# Altium schematic sheet Connectors.SchDoc
size Letter; SheetNumber: 1; SheetTotal: 9
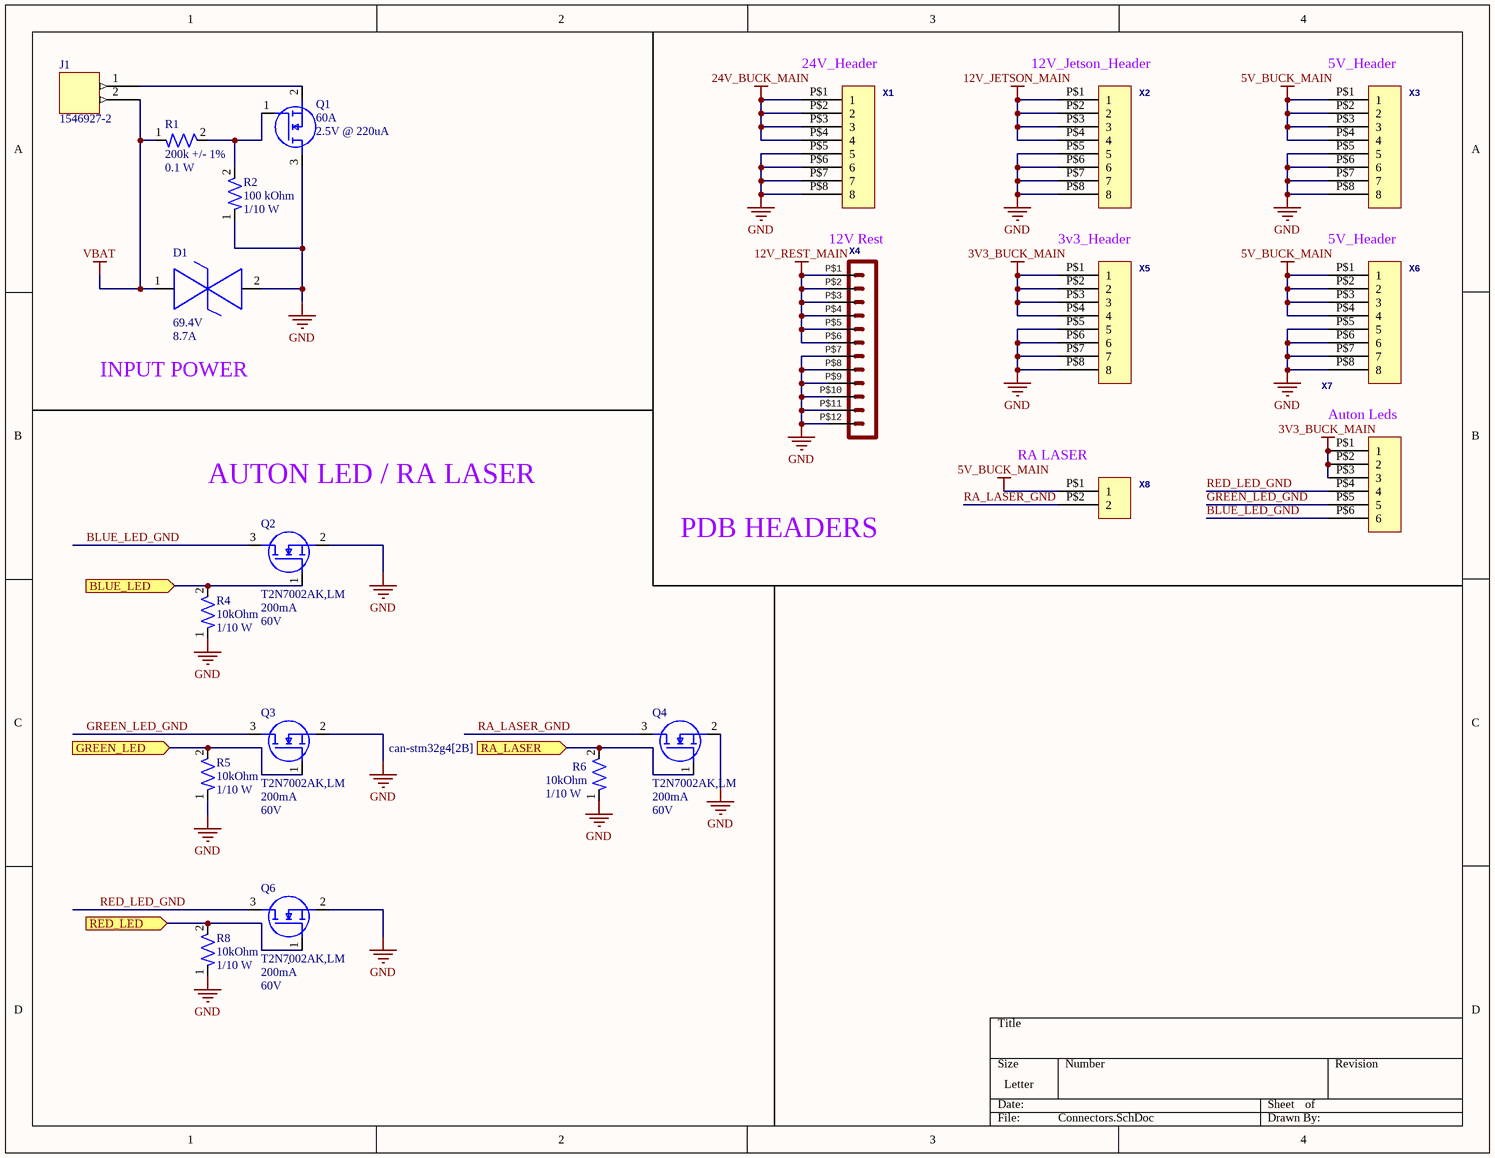
[diagram p0: Connectors.SchDoc]

## Parts
D1  Vclamp: 69.4V  Peak pulser current: 8.7A  [DO-214AA (SMBJ)]  (hidden comment: SMBJE43CAH)
J1  1546927-2  [CONN-1546927-2]
Q1  Drain Current: 60A  Vgs: 2.5V @ 220uA  [NMOS-8PowerVDFN]  (hidden comment: TPH7R006PL,L1Q)
Q2  T2N7002AK,LM  Id-Continuous: 200mA  VDS-Max: 60V  [NMOS-SOT23-3]
Q3  T2N7002AK,LM  Id-Continuous: 200mA  VDS-Max: 60V  [NMOS-SOT23-3]
Q4  T2N7002AK,LM  Id-Continuous: 200mA  VDS-Max: 60V  [NMOS-SOT23-3]
Q6  T2N7002AK,LM  Id-Continuous: 200mA  VDS-Max: 60V  [NMOS-SOT23-3]
R1  Resistance: 200k +/- 1%  Power Rating: 0.1 W  [RES-0603]  (hidden comment: ERJ-3EKF2003V)
R2  Resistance: 100 kOhm  Power: 1/10 W  [RES-0603]  (hidden comment: RC0603FR-07100KL)
R4  Resistance: 10kOhm  Power: 1/10 W  [RES-0603]  (hidden comment: RMCF0603ZT0R00)
R5  Resistance: 10kOhm  Power: 1/10 W  [RES-0603]  (hidden comment: RMCF0603ZT0R00)
R6  Resistance: 10kOhm  Power: 1/10 W  [RES-0603]  (hidden comment: RMCF0603ZT0R00)
R8  Resistance: 10kOhm  Power: 1/10 W  [RES-0603]  (hidden comment: RMCF0603ZT0R00)
X1  Molex 43045-0812  [43045-0812]  (value not drawn)
X2  Molex 43045-0812  [43045-0812]  (value not drawn)
X3  Molex 43045-0812  [43045-0812]  (value not drawn)
X4  Molex - Micro-Fit 3.0 Series connector,  3.00mm (0.118") pitch header, 12 positions.  [43045-1212]  (value not drawn)
X5  Molex 43045-0812  [43045-0812]  (value not drawn)
X6  Molex 43045-0812  [43045-0812]  (value not drawn)
X7  Molex 43045-0612  [43045-0612]  (value not drawn)
X8  Molex 43650-0215  [43650-0215]  (value not drawn)

## Ports
BLUE_LED (in, see can-stm32g4[2C]), GREEN_LED (in, see can-stm32g4[2C]), RA_LASER (in, see can-stm32g4[2B]), RED_LED (in, see can-stm32g4[2C])

## Nets
3V3_BUCK_MAIN: X5.P$1(1) X5.P$2(2) X5.P$3(3) X5.P$4(4) X7.P$1(1) X7.P$2(2) X7.P$3(3)
5V_BUCK_MAIN: X3.P$1(1) X3.P$2(2) X3.P$3(3) X3.P$4(4) X6.P$1(1) X6.P$2(2) X6.P$3(3) X6.P$4(4) X8.P$1(1)
12V_JETSON_MAIN: X2.P$1(1) X2.P$2(2) X2.P$3(3) X2.P$4(4)
12V_REST_MAIN: X4.P$1 X4.P$2 X4.P$3 X4.P$4 X4.P$5 X4.P$6
24V_BUCK_MAIN: X1.P$1(1) X1.P$2(2) X1.P$3(3) X1.P$4(4)
GND: D1.2 Q1.3(D) Q2.2(S) Q3.2(S) Q4.2(S) Q6.2(S) R2.1 R4.1 R5.1 R6.1 R8.1 X1.P$5(5) X1.P$6(6) X1.P$7(7) X1.P$8(8) X2.P$5(5) X2.P$6(6) X2.P$7(7) X2.P$8(8) X3.P$5(5) X3.P$6(6) X3.P$7(7) X3.P$8(8) X4.P$7 X4.P$8 X4.P$9 X4.P$10 X4.P$11 X4.P$12 X5.P$5(5) X5.P$6(6) X5.P$7(7) X5.P$8(8) X6.P$5(5) X6.P$6(6) X6.P$7(7) X6.P$8(8)
VBAT: D1.1 J1.2 R1.1
BLUE_LED: Q2.1(G) R4.2 ; port BLUE_LED
BLUE_LED_GND: Q2.3(D) X7.P$6(6)
GREEN_LED: Q3.1(G) R5.2 ; port GREEN_LED
GREEN_LED_GND: Q3.3(D) X7.P$5(5)
RA_LASER: Q4.1(G) R6.2 ; port RA_LASER
RA_LASER_GND: Q4.3(D) X8.P$2(2)
RED_LED: Q6.1(G) R8.2 ; port RED_LED
RED_LED_GND: Q6.3(D) X7.P$4(4)
NetJ1_1: J1.1 Q1.2(S)
NetQ1_1: Q1.1(G) R1.2 R2.2

## Notes on the sheet
- (near X1) 24V_Header
- (near X2) 12V_Jetson_Header
- (near X3) 5V_Header
- 12V Rest
- 3v3_Header
- 5V_Header
- INPUT POWER
- Auton Leds
- AUTON LED / RA LASER
- (near X8) RA LASER
- PDB HEADERS

## Library data of the parts
D1 = DIO-69.4V-0001: 69.4V Clamp 8.7A Ipp Tvs Diode Surface Mount DO-214AA (SMBJ); Channels: Bidirectional; Breakdown VOltage: 47.8V; Reverse working maximum voltage: 43V; Package: DO-214AA (SMBJ)
J1 = CON-2POS-0003
Q1 = NMOS-60A-0001: N-Channel 60 V 60A (Tc) 81W (Tc) Surface Mount 8-SOP Advance (5x5); Vdss: 60V; Vgs(Max): 20V; Package: 8-PowerVDFN
Q2-Q4 Q6 = NMOS-200MA-0001: MOSFET N-CH 60V 200MA SOT23; Manufacturer: Toshiba; FET type: N-Channel; Rds On-Max: 3.9Ohm; Vgs-Max: 20V; Assembled?: no; Manufacturer Part Number: T2N7002AK,LM; Package: SOT-23-3
R1 = RES-200K-0001: 200 kOhms ±1% 0.1W, 1/10W Chip Resistor 0603 (1608 Metric) Automotive AEC-Q200 Thick Film; Manufacturer: Panasonic Electronic Components; Assembled?: Yes; MFP: ERJ-3EKF2003V; Package SIze: 0603
R2 = RES-100K-0003: 100 kOhms ±1% 0.1W, 1/10W Chip Resistor 0603 (1608 Metric) Moisture Resistant Thick Film; Tolerance: +/- 1%; Assembled?: No; Package Size: 0603
R4-R6 R8 = RES-0-0001: 0 Ohms Jumper 0.1W, 1/10W Chip Resistor 0603 (1608 Metric) Automotive AEC-Q200 Thick Film; Package Size: 0603
X1-X3 X5 X6 = Micro-Fit Molex 8 Pin 2 Row Vertical: GateName_1: G$1; SymbolName_1: HEADER_POS8; DeviceSetName: HEADER_POS8_?; DeviceName: 43045-0812; LibraryName: con-molex-micro-fit-3_0_2; Package: 43045-0812
X4 = HEADER_POS12_?43045-1212: GateName_1: G$1; SymbolName_1: HEADER_POS12; DeviceName: 43045-1212; LibraryName: con-molex-micro-fit-3_0_2; DeviceSetName: HEADER_POS12_?; Package: 43045-1212
X7 = Micro-Fit Molex 6 Pin 2 Row Vertical: GateName_1: G$1; SymbolName_1: HEADER_POS6; DeviceSetName: HEADER_POS6_?; DeviceName: 43045-0612; LibraryName: con-molex-micro-fit-3_0_2; Package: 43045-0612
X8 = Micro-Fit Molex 2 Pin Vertical: GateName_1: G$1; SymbolName_1: HEADER_POS2; DeviceSetName: HEADER_POS2_?; DeviceName: 43650-0215; LibraryName: con-molex-micro-fit-3_0_2; Package: 43650-0215